# Altium schematic sheet Alarms and Buttons.SchDoc
size A4; DocumentNumber: 8; SheetNumber: 6; SheetTotal: 11
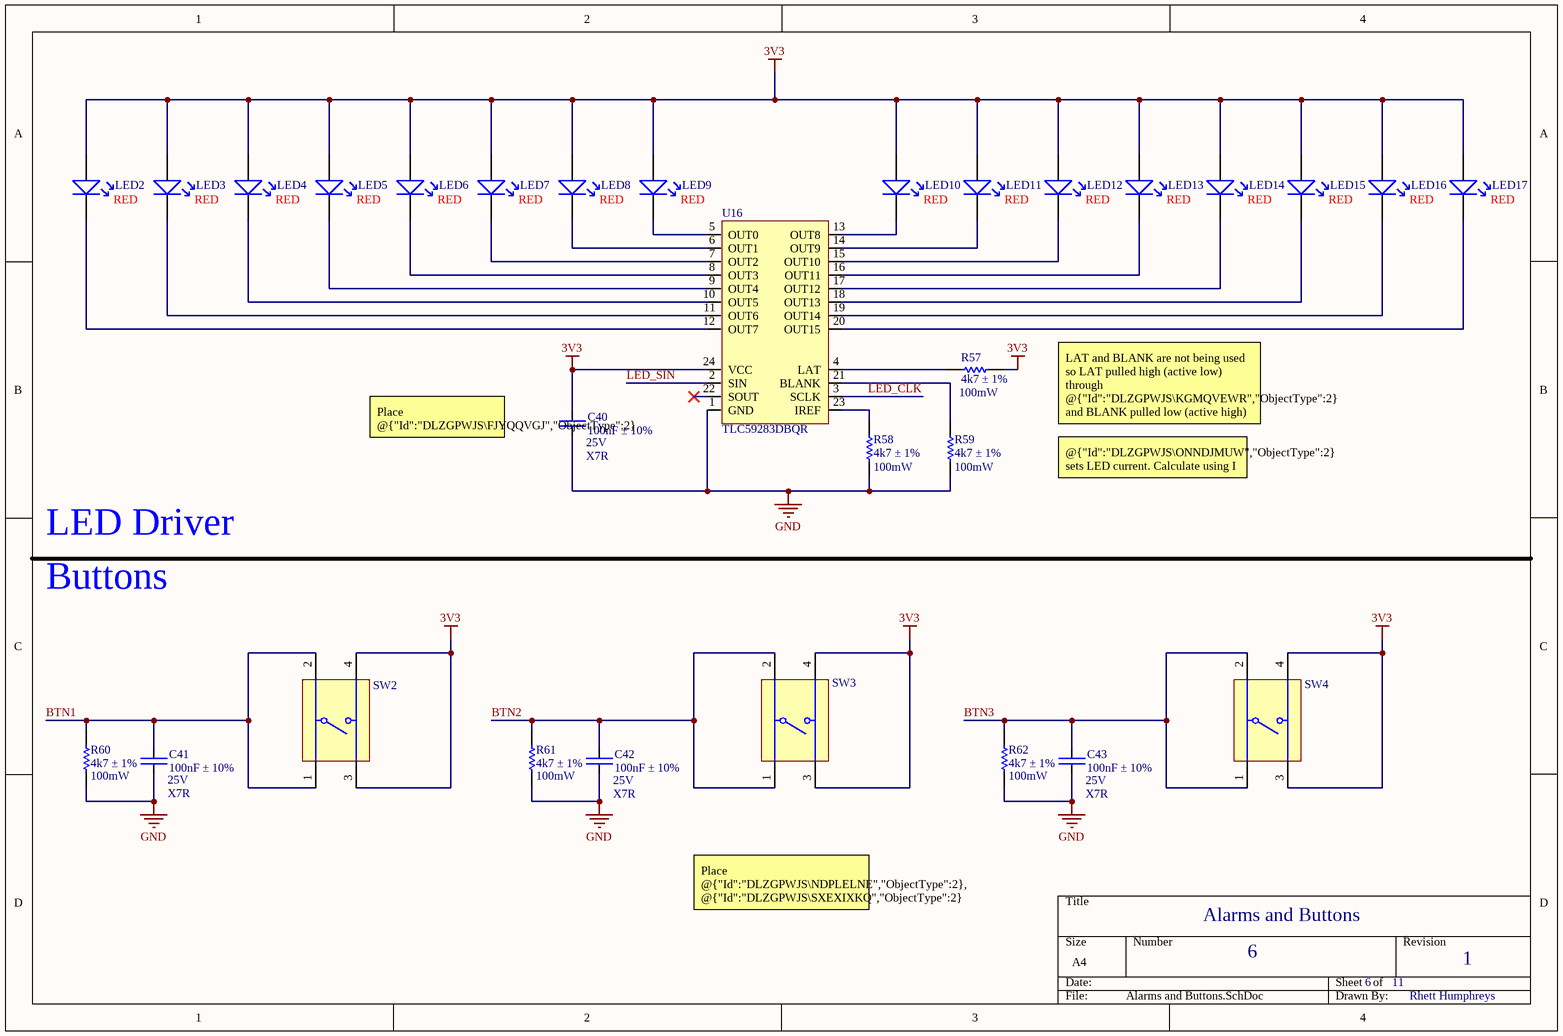
[diagram p0: Alarms and Buttons.SchDoc]

## Parts
C40  100nF ± 10%  [CAP-0603]
C41  100nF ± 10%  [CAP-0603]
C42  100nF ± 10%  [CAP-0603]
C43  100nF ± 10%  [CAP-0603]
LED2  (no value)  [0603 LED]
LED3  (no value)  [0603 LED]
LED4  (no value)  [0603 LED]
LED5  (no value)  [0603 LED]
LED6  (no value)  [0603 LED]
LED7  (no value)  [0603 LED]
LED8  (no value)  [0603 LED]
LED9  (no value)  [0603 LED]
LED10  (no value)  [0603 LED]
LED11  (no value)  [0603 LED]
LED12  (no value)  [0603 LED]
LED13  (no value)  [0603 LED]
LED14  (no value)  [0603 LED]
LED15  (no value)  [0603 LED]
LED16  (no value)  [0603 LED]
LED17  (no value)  [0603 LED]
R57  4k7 ± 1%  [RES-0603]
R58  4k7 ± 1%  [RES-0603]
R59  4k7 ± 1%  [RES-0603]
R60  4k7 ± 1%  [RES-0603]
R61  4k7 ± 1%  [RES-0603]
R62  4k7 ± 1%  [RES-0603]
SW2  FSM4JSMATR  [TECO-FSM4JSMATR_V]  (value not drawn)
SW3  FSM4JSMATR  [TECO-FSM4JSMATR_V]  (value not drawn)
SW4  FSM4JSMATR  [TECO-FSM4JSMATR_V]  (value not drawn)
U16  TLC59283DBQR  [SOP64P600X175-24N]

## Nets
3V3: C40.2 LED2.1 LED3.1 LED4.1 LED5.1 LED6.1 LED7.1 LED8.1 LED9.1 LED10.1 LED11.1 LED12.1 LED13.1 LED14.1 LED15.1 LED16.1 LED17.1 R57.2 SW2.3 SW2.4 SW3.3 SW3.4 SW4.3 SW4.4 U16.24(VCC)
GND: C40.1 C41.1 C42.1 C43.1 R58.1 R59.1 R60.2 R61.2 R62.2 U16.1(GND)
BTN1: C41.2 R60.1 SW2.1 SW2.2
BTN2: C42.2 R61.1 SW3.1 SW3.2
BTN3: C43.2 R62.1 SW4.1 SW4.2
LED_CLK: U16.3(SCLK)
LED_SIN: U16.2(SIN)
NetLED2_2: LED2.2 U16.12(OUT7)
NetLED3_2: LED3.2 U16.11(OUT6)
NetLED4_2: LED4.2 U16.10(OUT5)
NetLED5_2: LED5.2 U16.9(OUT4)
NetLED6_2: LED6.2 U16.8(OUT3)
NetLED7_2: LED7.2 U16.7(OUT2)
NetLED8_2: LED8.2 U16.6(OUT1)
NetLED9_2: LED9.2 U16.5(OUT0)
NetLED10_2: LED10.2 U16.13(OUT8)
NetLED11_2: LED11.2 U16.14(OUT9)
NetLED12_2: LED12.2 U16.15(OUT10)
NetLED13_2: LED13.2 U16.16(OUT11)
NetLED14_2: LED14.2 U16.17(OUT12)
NetLED15_2: LED15.2 U16.18(OUT13)
NetLED16_2: LED16.2 U16.19(OUT14)
NetLED17_2: LED17.2 U16.20(OUT15)
NetR57_1: R57.1 U16.4(LAT)
NetR58_2: R58.2 U16.23(IREF)
NetR59_2: R59.2 U16.21(BLANK)

Not connected (* = marked no-connect by the designer): U16 22(SOUT)*

## Notes on the sheet
- RED
- (near LED17) RED
- Place @{"Id":"DLZGPWJS\FJYQQVGJ","ObjectType":2} as close as possible to @{"Id":"DLZGPWJS\TYZPLYAJ","ObjectType":2}
- (near C40) 25V
- (near R57) 100mW
- LAT and BLANK are not being used so LAT pulled high (active low) through @{"Id":"DLZGPWJS\KGMQVEWR","ObjectType":2} and BLANK pulled low (active high) through @{"Id":"DLZGPWJS\VQHHMAKD","ObjectType":2}
- (near C40) X7R
- (near R58) 100mW
- (near R59) 100mW
- @{"Id":"DLZGPWJS\ONNDJMUW","ObjectType":2} sets LED current. Calculate using I = (43.8 * 1.208) / R_IREF.
- LED Driver
- Buttons
- (near R60) 100mW
- (near C41) 25V
- (near R61) 100mW
- (near C42) 25V
- (near R62) 100mW
- (near C43) 25V
- (near C41) X7R
- (near C42) X7R
- (near C43) X7R
- Place @{"Id":"DLZGPWJS\NDPLELNE","ObjectType":2}, @{"Id":"DLZGPWJS\SXEXIXKQ","ObjectType":2} and @{"Id":"DLZGPWJS\PBKEKCZD","ObjectType":2} as close as possible to GPIO pins used for buttons of @{"Id":"YEMLWZAK\HIGJTEGZ","ObjectType":2}
- Alarms and Buttons
- 6
- 11
- 1
- Rhett Humphreys

## Library data of the parts
C40-C43 = CAP-0603: Capacitor chip unpolarized. 0603
LED2-LED17 = 0603 LED
R57-R62 = RES-0603: Resistor chip. 0603
SW2-SW4 = CMP-2000-07486-1: Micro Miniature Push Button Switch FSM JSM, 50 mA, -35 to 85 degC, 4-Pin SMD, RoHS, Tape and Reel; Manufacturer: TE Connectivity; Mechanical Life: 100000Cycles; Current Rating: 50mA; Actuator Material: Polyamide; Max Voltage Rating (DC): 12V; Capacitance: 0f; Illumination Type: Illuminated; Voltage Rating (DC): 24V; Case\/Package: SMD/SMT; Operating Force: 160gf; Contact Resistance: 100mOhm; Actuator Length: 0.055inch; Switch Travel: 0.25mm; Throw Configuration: SPST; Termination: GullWing; Contact Plating: Silver; Orientation: Straight; Mounting Technology: SurfaceMount; REACH SVHC: Unknown; Electrical Life: 100000Cycles; Package Reference: FSM4JSMATR; Max Operating Temperature: 85degC; Manufacturer URL: http://www.te.com/; Package Description: 4-Pin Surface Mount Device, Body 6 x 6 mm, Pitch 4.5 mm; Datasheet Version: Rev. V, 02/2015; Packaging: TapeandReel; Min Operating Temperature: -35degC; Mount: SurfaceMount; Contact Current Rating: 50mA; Contact Material: CopperAlloy; Package Quantity: 1200; Datasheet URL: http://www.te.com/commerce/DocumentDelivery/DDEController?Action=showdoc&DocId=Customer+Drawing%7F2-1437565-7%7FV%7Fpdf%7FEnglish%7FENG_CD_2-1437565-7_V.pdf%7F4-1437565-2; RoHSCompliant: true
U16 = TLC59283DBQR: LED Driver Const Current 16 Output